# Altium schematic sheet Connectors.SchDoc
size A4; CompanyName: Technische Hochschule Nürnberg Georg Simon Ohm; Organization: UltraZohm; Address1: Kesslerplatz 12; Address2: 90489 Nürnberg; Address3: GERMANY; SheetNumber: 3; SheetTotal: 8; Website: www.ultrazohm.com
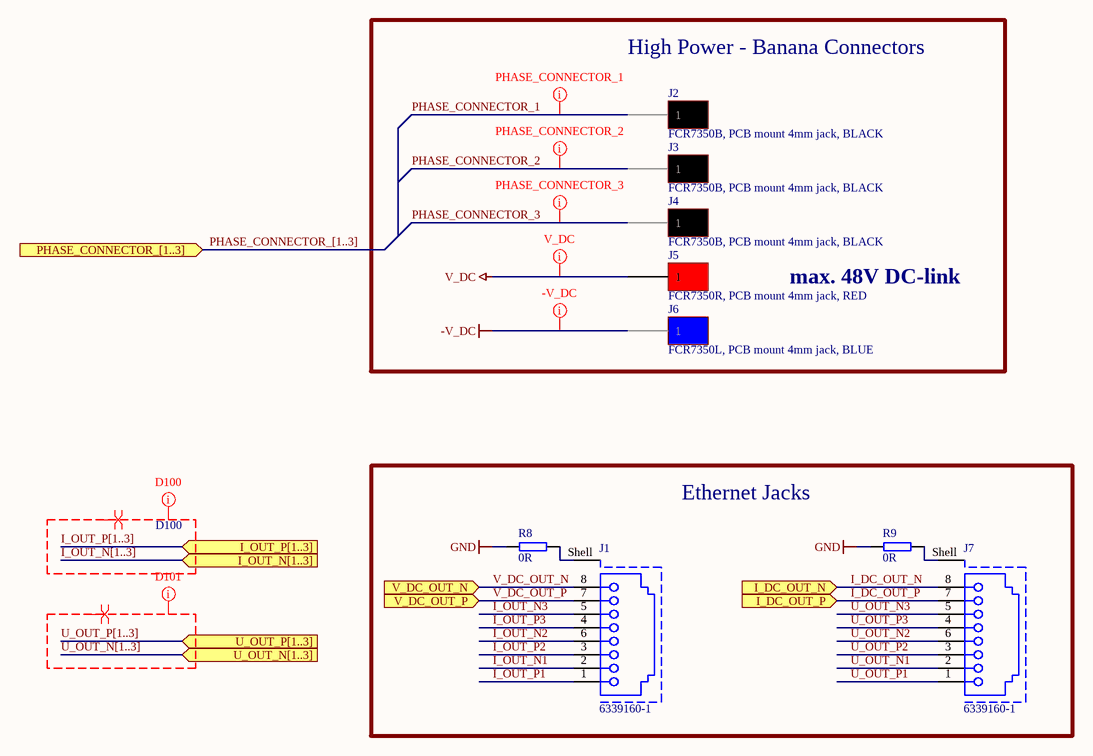
[diagram p0: Connectors.SchDoc]

## Parts
J1  6339160-1  [634008149821]
J2  FCR7350B, PCB mount 4mm jack, BLACK  [FCR7350]
J3  FCR7350B, PCB mount 4mm jack, BLACK  [FCR7350]
J4  FCR7350B, PCB mount 4mm jack, BLACK  [FCR7350]
J5  FCR7350R, PCB mount 4mm jack, RED  [FCR7350]
J6  FCR7350L, PCB mount 4mm jack, BLUE  [FCR7350]
J7  6339160-1  [634008149821]
R8  0R  [RES 0603_1608]
R9  0R  [RES 0603_1608]

## Blocks framed on the sheet
Ethernet Jacks: J1 J7 R8 R9

## Ports
I_DC_OUT_N (in), I_DC_OUT_P (in), I_OUT_N[1..3] (in), I_OUT_P[1..3] (in), PHASE_CONNECTOR_[1..3] (in), U_OUT_N[1..3] (in), U_OUT_P[1..3] (in), V_DC_OUT_N (in), V_DC_OUT_P (in)

## Nets
-V_DC: J6.1
GND: R8.1 R9.1
V_DC: J5.1
I_DC_OUT_N: J7.8 ; port I_DC_OUT_N
I_DC_OUT_P: J7.7 ; port I_DC_OUT_P
I_OUT_N1: J1.2
I_OUT_N2: J1.6
I_OUT_N3: J1.5
I_OUT_P1: J1.1
I_OUT_P2: J1.3
I_OUT_P3: J1.4
PHASE_CONNECTOR_1: J2.1
PHASE_CONNECTOR_2: J3.1
PHASE_CONNECTOR_3: J4.1
U_OUT_N1: J7.2
U_OUT_N2: J7.6
U_OUT_N3: J7.5
U_OUT_P1: J7.1
U_OUT_P2: J7.3
U_OUT_P3: J7.4
V_DC_OUT_N: J1.8 ; port V_DC_OUT_N
V_DC_OUT_P: J1.7 ; port V_DC_OUT_P
NetJ1_Shell: J1.Shell R8.2
NetJ7_Shell: J7.Shell R9.2

## Buses and harness runs
bus I_OUT_N[1..3] = port I_OUT_N[1..3]
bus I_OUT_P[1..3] = port I_OUT_P[1..3]
bus PHASE_CONNECTOR_[1..3] = port PHASE_CONNECTOR_[1..3]
bus U_OUT_N[1..3] = port U_OUT_N[1..3]
bus U_OUT_P[1..3] = port U_OUT_P[1..3]

## Layout directives
differential pair: I_OUT_N[1..3], I_OUT_P[1..3], U_OUT_N[1..3], U_OUT_P[1..3]
net class D100: I_OUT_N[1..3], I_OUT_P[1..3]
mark named D101: U_OUT_N[1..3], U_OUT_P[1..3]
net class Power: -V_DC, PHASE_CONNECTOR_1, PHASE_CONNECTOR_2, PHASE_CONNECTOR_3, V_DC

## Notes on the sheet
- High Power - Banana Connectors
- max. 48V DC-link
- Title
- Revision:
- Design Engineer:
- Date:
- Project:
- Sheet
- of

## Library data of the parts
J1 J7 = 6339160-1: RJ45 RJReceptacle 1 Yes cat5 Without LED SMD Ethernet Connectors/Modular Connectors (RJ45 RJ11) ROHS; Manufacturer: TE; Match Code: WR-MJ; Contact Resistance: 20mOhm; Insulation Resistance: 500MOhm; LED: No; Number of Ports: 1; Rated Current: 1.5A; Working Voltage: 120VAC; Withstanding Voltage: 1000VAC; Created from: NDiringer; ComponentLink1Description: Datasheet; ComponentLink1URL: https://jlcpcb.com/partdetail/TeConnectivity-63391601/C125076; ComponentLink2Description: Datasheet; ComponentLink2URL: https://www.we-online.com/redexpert/spec/634008149821?ad; Category: Input/Output Connectors; Manufacturer Part Number: 6339160-1; Mount: Surface Mount; Operating Temperature Max: 85°C; Operating Temperature Min: -40°C; Packaging: Tray; Number of Pins: 8P8C; Orientation: Horizontal; Shielding: Yes; PartID: 8; Created On: 4/20/2023 12:29:11 PM; Component Type: RJ45 Connector; Device Package: RJ45; Last Updated: 4/20/2023 12:29:11 PM; Mounting Type: SMD; Series: RJHSE; Supplier 1: LCSC; Supplier Part Number 1: C125076; Type: RJ45 Connector; Live Cycle Status: 1; Stock number: not stored; LCSC Part Number: C125076
J2-J4 = FCR7350B: FCR7350B, 1000V, 24A, BLACK; Manufacturer: Cliff; Value: PCB mount 4mm jack, Black	FCR7350B, 1000V, 24A; Created from: DHufnagel; Manufacturer Part Number: FCR7350B; PartID: 6; Created On: 6/13/2022 10:18:11 AM; ComponentLink1Description: datasheet; ComponentLink1URL: https://www.cliffuk.co.uk/products/testleads/sockets/S16NPC.pdf; ComponentLink2Description: drawing; ComponentLink2URL: https://media.digikey.com/pdf/Data%20Sheets/Cliff%20Electronic%20LTD%20PDF's/FCR7350_Drawing.pdf; Component Type: PCB mount 4mm jack, Black; Device Package: THT; Last Updated: 6/28/2022 1:58:37 PM; Minimum Order: 1; Mounting Type: THT; Operating Temperature: -40°C - 80°C; Series: S16N-PC; Supplier 1: Digi-Key; Supplier Part Number 1: 3185-FCR7350B-ND; Supplier 2: farnell; Supplier Part Number 2: 1854507; Type: PCB mount 4mm jack, Black	FCR7350B, 1000V, 24A; Live Cycle Status: 1; Stock number: not stored
J5 = FCR7350R: FCR7350B, 1000V, 24A, RED; Manufacturer: Cliff; Value: PCB mount 4mm jack, Red FCR7350R, 1000V, 24A; Created from: DHufnagel; Manufacturer Part Number: FCR7350R; PartID: 7; Created On: 6/13/2022 10:18:11 AM; ComponentLink1Description: datasheet; ComponentLink1URL: https://www.cliffuk.co.uk/products/testleads/sockets/S16NPC.pdf; ComponentLink2Description: drawing; ComponentLink2URL: https://media.digikey.com/pdf/Data%20Sheets/Cliff%20Electronic%20LTD%20PDF's/FCR7350_Drawing.pdf; Component Type: PCB mount 4mm jack, Red; Device Package: THT; Last Updated: 6/28/2022 1:58:37 PM; Minimum Order: 1; Mounting Type: THT; Operating Temperature: -40°C - 80°C; Series: S16N-PC; Supplier 1: Digi-Key; Supplier Part Number 1: 3185-FCR7350R-ND; Supplier 2: farnell; Supplier Part Number 2: 1854508; Type: PCB mount 4mm jack, Red FCR7350R, 1000V, 24A; Live Cycle Status: 1; Stock number: not stored
J6 = FCR7350L: FCR7350B, 1000V, 24A, BLUE; Manufacturer: Cliff; Value: PCB mount 4mm jack, Blue FCR7350L, 1000V, 24A; Created from: DHufnagel; Manufacturer Part Number: FCR7350L; PartID: 8; Created On: 6/13/2022 10:18:11 AM; ComponentLink1Description: datasheet; ComponentLink1URL: https://www.cliffuk.co.uk/products/testleads/sockets/S16NPC.pdf; ComponentLink2Description: drawing; ComponentLink2URL: https://media.digikey.com/pdf/Data%20Sheets/Cliff%20Electronic%20LTD%20PDF's/FCR7350_Drawing.pdf; Component Type: PCB mount 4mm jack, Blue; Device Package: THT; Last Updated: 6/28/2022 1:58:37 PM; Minimum Order: 1; Mounting Type: THT; Operating Temperature: -40°C - 80°C; Series: S16N-PC; Supplier 1: Digi-Key; Supplier Part Number 1: 3185-FCR7350L-ND; Supplier 2: farnell; Supplier Part Number 2: 1854511; Type: PCB mount 4mm jack, Blue FCR7350L, 1000V, 24A; Live Cycle Status: 1; Stock number: not stored
R8 R9 = RC0603JR-070RL: SMD resistor E24 series; Manufacturer: YAGEO; Tolerance: 5%; Created from: MGremer; Manufacturer Part Number: RC0603JR-070RL; PartID: 1; Created On: 12/14/2020 4:17:14 PM; ComponentLink1Description: Datasheet; ComponentLink1URL: https://www.mouser.de/datasheet/2/447/PYu-RC_Group_51_RoHS_L_10-1664068.pdf; Component Type: SMD resistor; Device Package: 0603; Last Updated: 3/4/2021 9:09:42 AM; Mounting Type: SMD; Supplier 1: Mouser; Supplier Part Number 1: 603-RC0603JR-070RL; Supplier 2: LCSC; Supplier Part Number 2: C21189; Type: Resistor; Value: 0R; Live Cycle Status: 1; Stock number: Labor SMD Container; LCSC Part Number: C21189